# Altium schematic sheet Debug.SchDoc
size A; DrawnBy: TIMKEN; SheetNumber: 4; SheetTotal: 7
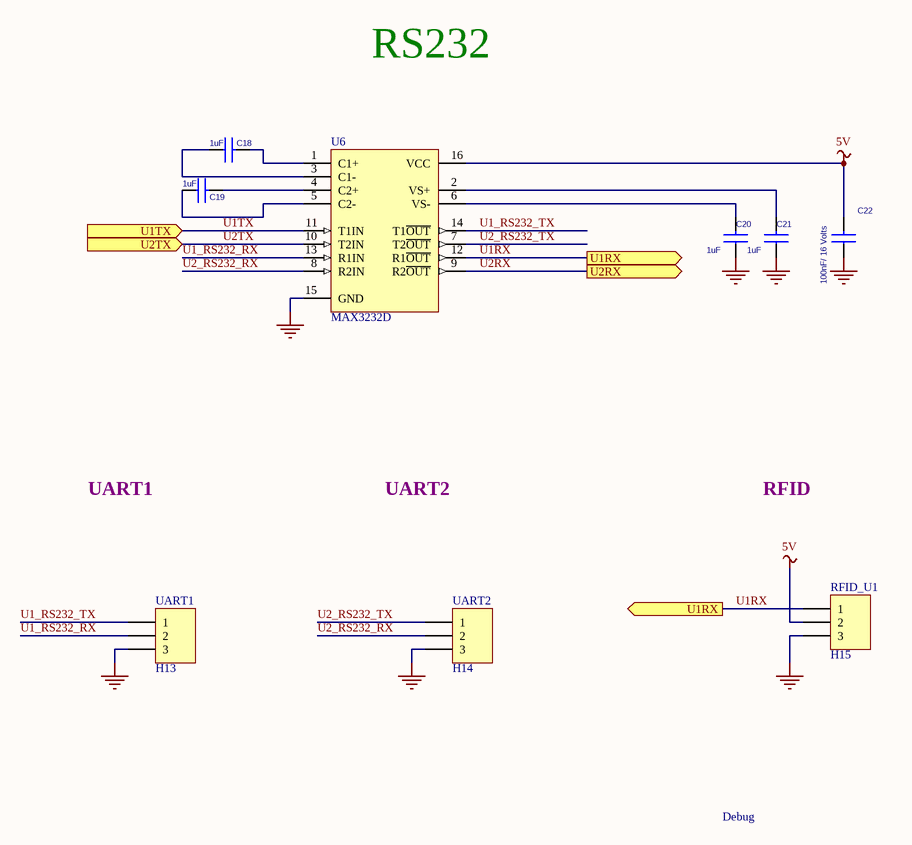
[diagram p0: Debug.SchDoc]

## Parts
C18  1uF  [CAP_CERAMIC]
C19  1uF  [CAP_CERAMIC]
C20  1uF  [CAP_CERAMIC]
C21  1uF  [CAP_CERAMIC]
C22  100nF/ 16 Volts  [CAP_CERAMIC]
RFID_U1  H15  [1x3_single - duplicate]
U6  MAX3232D  [MAX232D]
UART1  H13  [1x3_single - duplicate]
UART2  H14  [1x3_single - duplicate]

## Ports
U1RX (out), U1TX (in), U2RX (out), U2TX (in)

## Nets
5V: C22.2 RFID_U1.2 U6.16(VCC)
GND_POWER: C20.1 C21.1 C22.1 RFID_U1.3 U6.15(GND) UART1.3 UART2.3
U1_RS232_RX: U6.13(R1IN) UART1.2
U1_RS232_TX: U6.14(T1~{OUT}) UART1.1
U1RX: RFID_U1.1 U6.12(R1~{OUT}) ; port U1RX
U1TX: U6.11(T1IN) ; port U1TX
U2_RS232_RX: U6.8(R2IN) UART2.2
U2_RS232_TX: U6.7(T2~{OUT}) UART2.1
U2RX: U6.9(R2~{OUT}) ; port U2RX
U2TX: U6.10(T2IN) ; port U2TX
NetC18_1: C18.1 U6.3(C1-)
NetC18_2: C18.2 U6.1(C1+)
NetC19_1: C19.1 U6.5(C2-)
NetC19_2: C19.2 U6.4(C2+)
NetC20_2: C20.2 U6.6(VS-)
NetC21_2: C21.2 U6.2(VS+)

## Notes on the sheet
- RS232
- UART1
- UART2
- RFID
- Debug

## Library data of the parts
C18-C22 = CAP NP: V P No: 644160RL; Vendor: Farnell; M P No: CC0805KRX7R7BB104; Descr: CAPACITOR, 0805, 100NF, 16V, X7R; FootPrint: C0805
RFID_U1 UART1 UART2 = Header 3: Header, 3-Pin; LatestRevisionDate: 17-Jul-2002; LatestRevisionNote: Re-released for DXP Platform.; Publisher: Altium Limited
U6 = MAX232D: Dual EIA-232 Driver/Receiver; Note: Receivers have typical hysteresis of 0.5V; Published: 15-May-2002; LatestRevisionDate: 13-Apr-2006; LatestRevisionNote: IPC-7351 Footprint Added.; DatasheetVersion: Jun-1989; PackageVersion: Jan-1998; PackageReference: D016; Publisher: Altium Limited; PackageDescription: 16-Pin Small Outline Integrated Circuit 1.27 mm Pitch; Code_IPC: SOIC127P600-16; ComponentLink1Description: Manufacturer Link; ComponentLink1URL: http://www.ti.com/; ComponentLink2Description: Datasheet; ComponentLink2URL: http://www-s.ti.com/sc/ds/max232.pdf